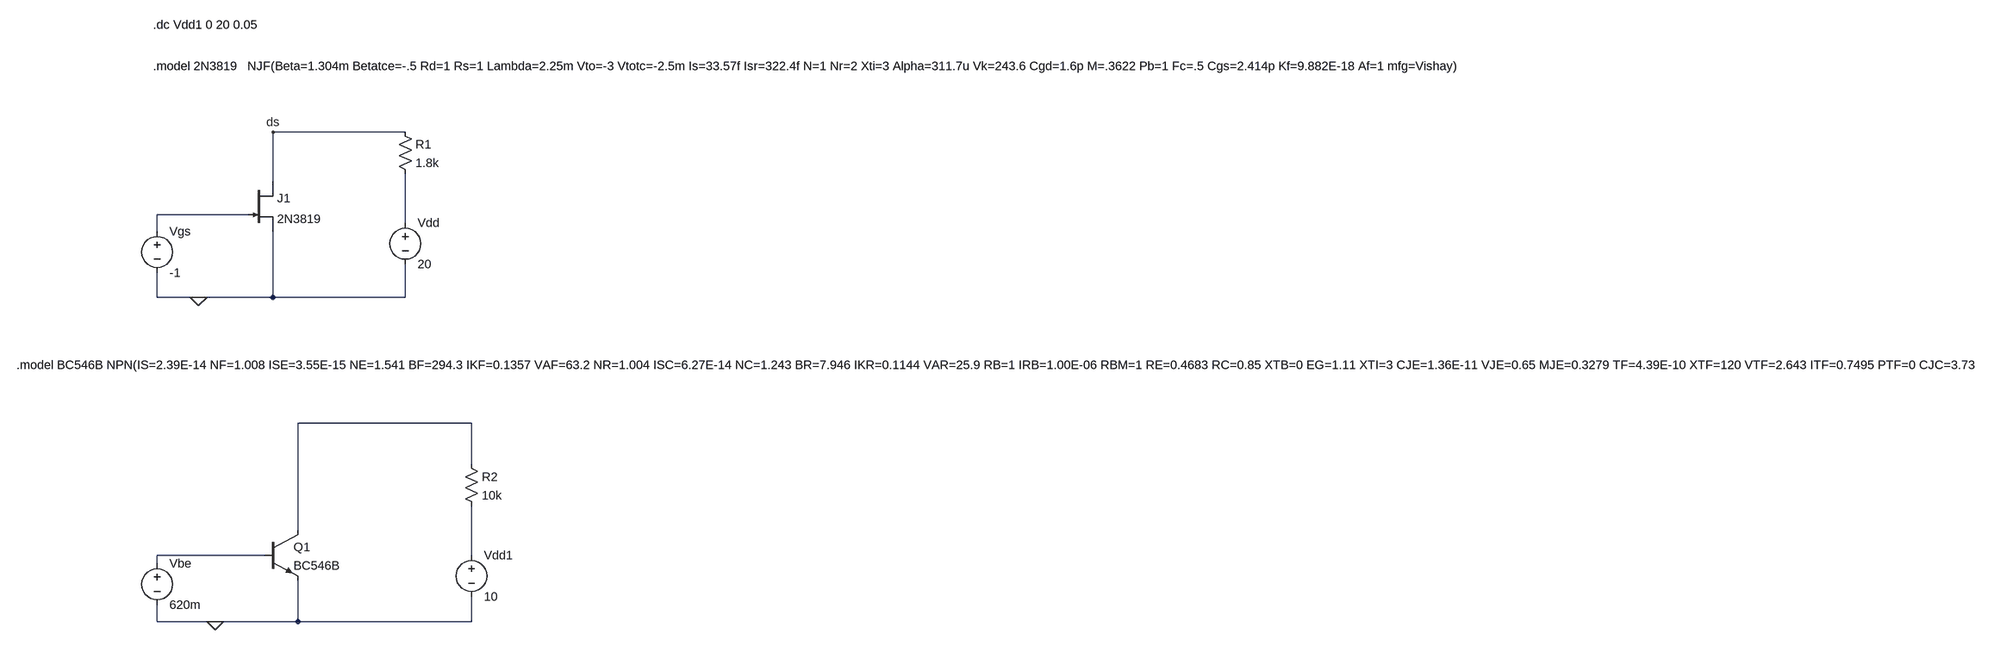
[diagram p0: schematic JFET_BJT.asc]
JFET_BJT.asc, the LTspice schematic file:
Version 4.1
SHEET 1 5292 1108
WIRE 416 16 160 16
WIRE 160 112 160 16
WIRE 112 176 -64 176
WIRE 416 192 416 96
WIRE -64 208 -64 176
WIRE -64 336 -64 288
WIRE 16 336 -64 336
WIRE 160 336 160 208
WIRE 160 336 16 336
WIRE 416 336 416 272
WIRE 416 336 160 336
WIRE 544 704 208 704
WIRE 544 784 544 704
WIRE 208 912 208 704
WIRE 144 960 -64 960
WIRE 544 960 544 864
WIRE -64 976 -64 960
WIRE -64 1088 -64 1056
WIRE 48 1088 -64 1088
WIRE 208 1088 208 1008
WIRE 208 1088 48 1088
WIRE 544 1088 544 1040
WIRE 544 1088 208 1088
FLAG 16 336 0
FLAG 160 16 ds
FLAG 48 1088 0
SYMBOL njf 112 112 R0
SYMATTR InstName J1
SYMATTR Value 2N3819
SYMBOL voltage -64 192 R0
WINDOW 123 0 0 Left 0
WINDOW 39 0 0 Left 0
SYMATTR InstName Vgs
SYMATTR Value -1
SYMBOL res 400 0 R0
SYMATTR InstName R1
SYMATTR Value 1.8k
SYMBOL voltage 416 176 R0
WINDOW 123 0 0 Left 0
WINDOW 39 0 0 Left 0
SYMATTR InstName Vdd
SYMATTR Value 20
SYMBOL npn 144 912 R0
SYMATTR InstName Q1
SYMATTR Value BC546B
SYMBOL voltage -64 960 R0
WINDOW 123 0 0 Left 0
WINDOW 39 0 0 Left 0
SYMATTR InstName Vbe
SYMATTR Value 620m
SYMBOL voltage 544 944 R0
WINDOW 123 0 0 Left 0
WINDOW 39 0 0 Left 0
SYMATTR InstName Vdd1
SYMATTR Value 10
SYMBOL res 528 768 R0
SYMATTR InstName R2
SYMATTR Value 10k
TEXT -72 -112 Left 2 !.model 2N3819   NJF(Beta=1.304m Betatce=-.5 Rd=1 Rs=1 Lambda=2.25m Vto=-3 Vtotc=-2.5m Is=33.57f Isr=322.4f N=1 Nr=2 Xti=3 Alpha=311.7u Vk=243.6 Cgd=1.6p M=.3622 Pb=1 Fc=.5 Cgs=2.414p Kf=9.882E-18 Af=1 mfg=Vishay)
TEXT -72 -192 Left 2 !.dc Vdd1 0 20 0.05
TEXT -336 592 Left 2 !.model BC546B NPN(IS=2.39E-14 NF=1.008 ISE=3.55E-15 NE=1.541 BF=294.3 IKF=0.1357 VAF=63.2 NR=1.004 ISC=6.27E-14 NC=1.243 BR=7.946 IKR=0.1144 VAR=25.9 RB=1 IRB=1.00E-06 RBM=1 RE=0.4683 RC=0.85 XTB=0 EG=1.11 XTI=3 CJE=1.36E-11 VJE=0.65 MJE=0.3279 TF=4.39E-10 XTF=120 VTF=2.643 ITF=0.7495 PTF=0 CJC=3.73E-12 VJC=0.3997 MJC=0.2955 XCJC=0.6193 TR=1.00E-32 CJS=0 VJS=0.75 MJS=0.333 FC=0.9579 Vceo=65 Icrating=100m mfg=NXP)

The netlist it stands for:
* JFET_BJT.asc
J1 ds N001 0 2N3819
Vgs N001 0 -1
R1 ds N002 1.8k
Vdd N002 0 20
Q1 N003 N004 0 0 BC546B
Vbe N004 0 620m
Vdd1 N005 0 10
R2 N003 N005 10k
.model NPN NPN
.model PNP PNP
.lib standard.bjt
.model NJF NJF
.model PJF PJF
.lib standard.jft
.model 2N3819   NJF(Beta=1.304m Betatce=-.5 Rd=1 Rs=1 Lambda=2.25m Vto=-3 Vtotc=-2.5m Is=33.57f Isr=322.4f N=1 Nr=2 Xti=3 Alpha=311.7u Vk=243.6 Cgd=1.6p M=.3622 Pb=1 Fc=.5 Cgs=2.414p Kf=9.882E-18 Af=1 mfg=Vishay)
.dc Vdd1 0 20 0.05
.model BC546B NPN(IS=2.39E-14 NF=1.008 ISE=3.55E-15 NE=1.541 BF=294.3 IKF=0.1357 VAF=63.2 NR=1.004 ISC=6.27E-14 NC=1.243 BR=7.946 IKR=0.1144 VAR=25.9 RB=1 IRB=1.00E-06 RBM=1 RE=0.4683 RC=0.85 XTB=0 EG=1.11 XTI=3 CJE=1.36E-11 VJE=0.65 MJE=0.3279 TF=4.39E-10 XTF=120 VTF=2.643 ITF=0.7495 PTF=0 CJC=3.73E-12 VJC=0.3997 MJC=0.2955 XCJC=0.6193 TR=1.00E-32 CJS=0 VJS=0.75 MJS=0.333 FC=0.9579 Vceo=65 Icrating=100m mfg=NXP)
.backanno
.end